# Altium schematic sheet Sheet1.SchDoc
size A2; DrawnBy: Баринов; Razrabotal: {Разработал}; Utverdil: {Утвердил}; Oboznachenie: {Обозначение}; PageSetup: Record=PageOptions|CenterHorizontal=True|CenterVertical=True|PrintScale=1.05|XCorrection=0.00|YCorrection=0.00|PrintKind=2|BorderSize=5000000|LeftOffset=0|BottomOffset=0|Orientation=2|PaperLength=1000|PaperWidth=1000|Scale=100|PaperSource=15|PrintQuality=-3|MediaType=1|DitherType=10|PrintScaleMode=1|PaperKind=ANSI D|PaperIndex=122
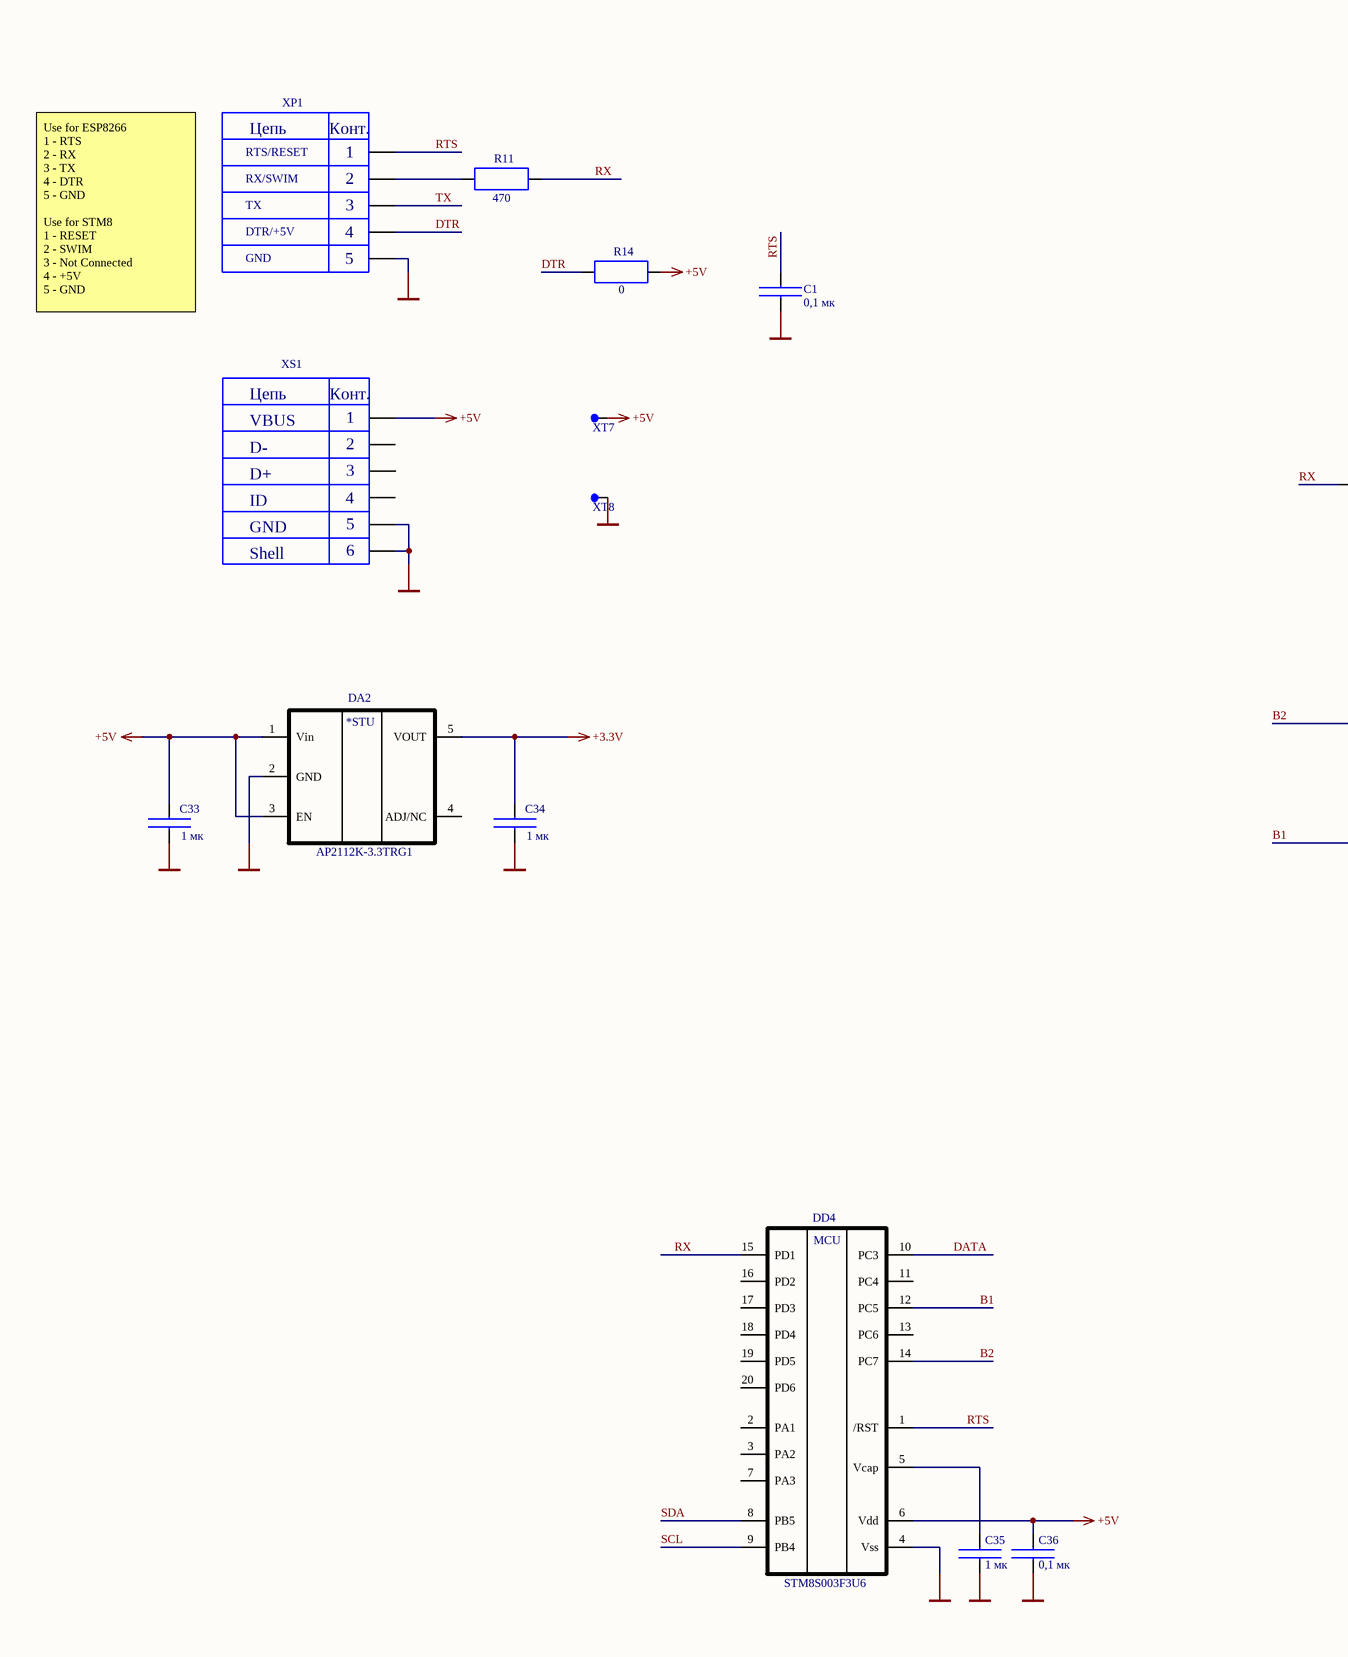
[diagram p0: Sheet1.SchDoc, left]
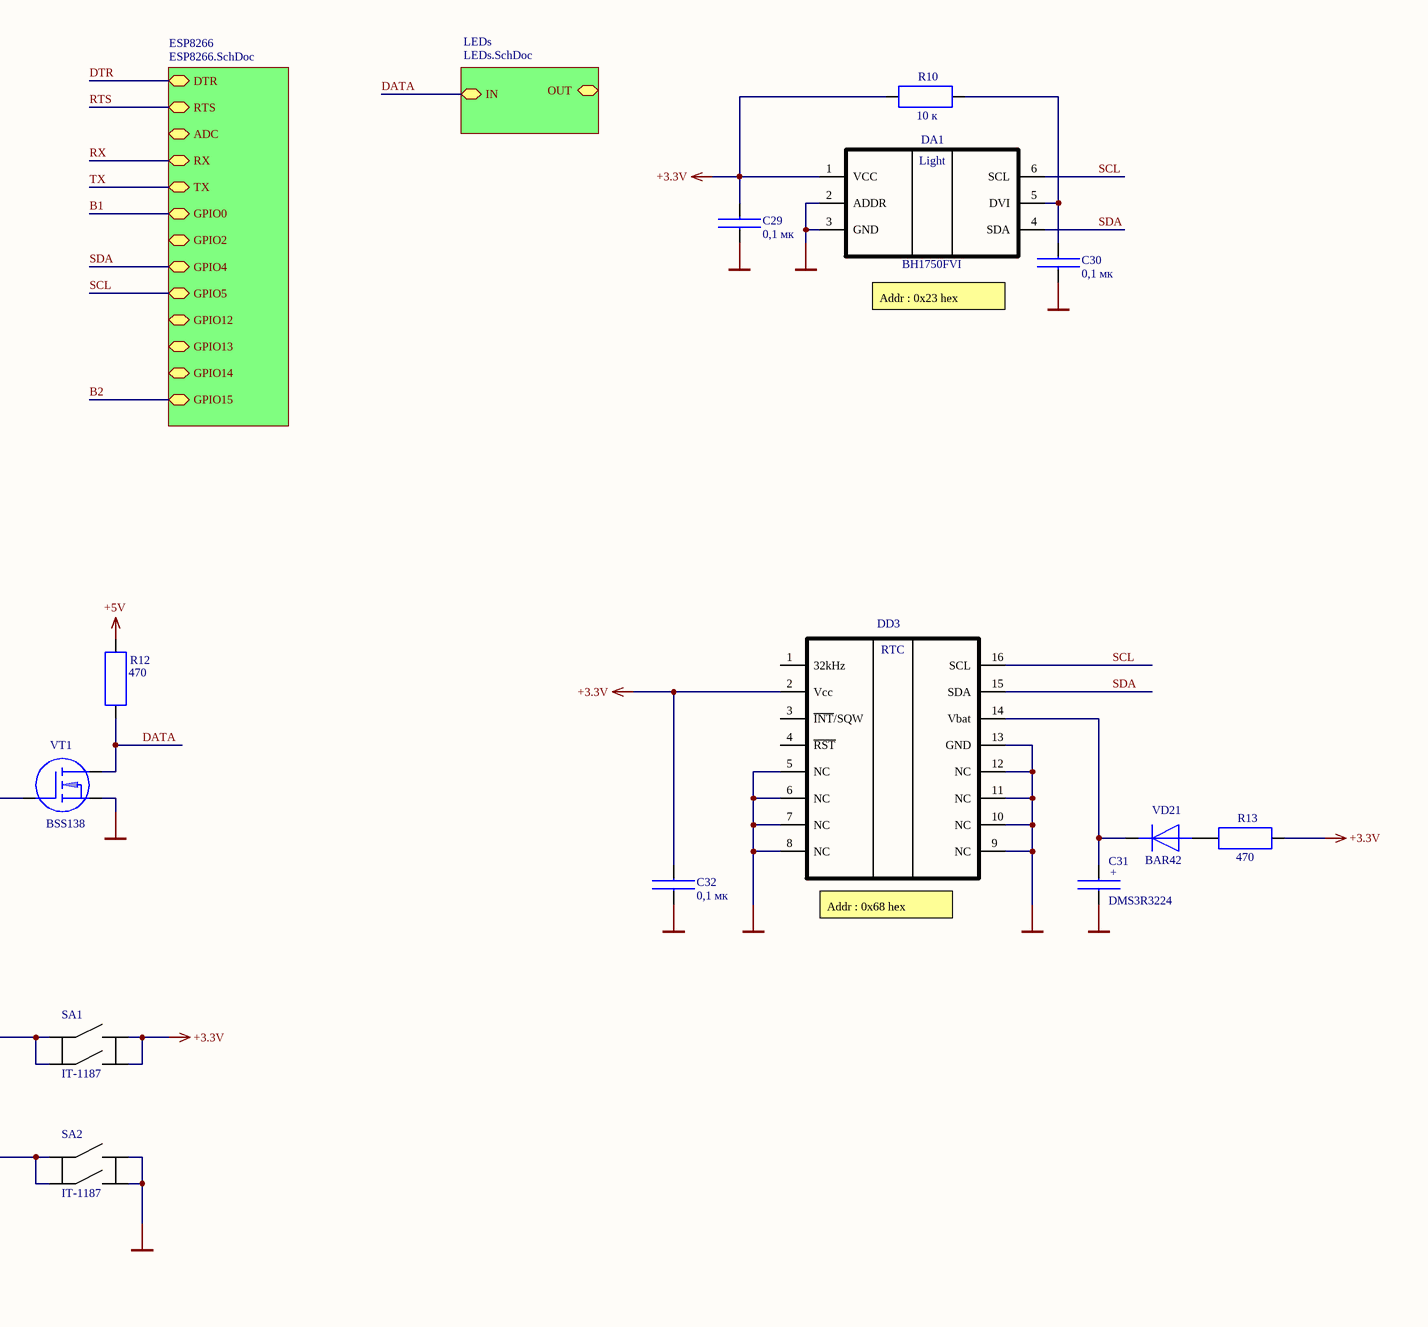
[diagram p1: Sheet1.SchDoc, right]

## Parts
C1  0,1 мк  [CC1608(0603)x09]
C29  0,1 мк  [CC1608(0603)x09]
C30  0,1 мк  [CC1608(0603)x09]
C31  DMS3R3224  [DMS3R3224]
C32  0,1 мк  [CC1608(0603)x09]
C33  1 мк  [CC1608(0603)x09]
C34  1 мк  [CC1608(0603)x09]
C35  1 мк  [CC1608(0603)x09]
C36  0,1 мк  [CC1608(0603)x09]
DA1  BH1750FVI  [WSOF6I]
DA2  AP2112K-3.3TRG1  [SOT23-5]
DD3  DS3231  [SOIC127P1030X250-16N]  (value not drawn)
DD4  STM8S003F3U6  [QFN50P300X300X55_HS-21N]
R10  10 к  [RC1608(0603)x06]
R11  470  [RC1608(0603)x06]
R12  470  [RC1608(0603)x06]
R13  470  [RC1608(0603)x06]
R14  0  [RC1608(0603)x06]
SA1  IT-1187  [IT-1187]
SA2  IT-1187  [IT-1187]
VD21  BAR42  [SOT-23]
VT1  BSS138  [SOT-23]
XP1  header5p_2.54  [header5p_2.54_no3d_noSilk]  (value not drawn)
XS1  USB/Mc-1J  [USB/Mc-1J]  (value not drawn)
XT7  XT3  [XT3]  (value not drawn)
XT8  XT3  [XT3]  (value not drawn)

## Sub-sheets
ESP8266 = ESP8266.SchDoc: DTR, RTS, ADC, RX, TX, GPIO0, GPIO2, GPIO4, GPIO5, GPIO12, GPIO13, GPIO14, GPIO15
LEDs = LEDs.SchDoc: IN, OUT

## Nets
+3.3V: C29.1 C32.1 C34.1 DA1.1(VCC) DA2.5(VOUT) DD3.2(Vcc) R10.2 R13.1 SA1.3 SA1.4
+5V: C33.1 C36.1 DA2.1(Vin) DA2.3(EN) DD4.6(Vdd) R12.2 R14.1 XS1.1 XT7.1
GND: C1.2 C29.2 C30.2 C31.- C32.2 C33.2 C34.2 C35.2 C36.2 DA1.2(ADDR) DA1.3(GND) DA2.2(GND) DD3.5(NC) DD3.6(NC) DD3.7(NC) DD3.8(NC) DD3.9(NC) DD3.10(NC) DD3.11(NC) DD3.12(NC) DD3.13(GND) DD4.4(Vss) SA2.3 SA2.4 VT1.2(S) XP1.5 XS1.5 XS1.SH(Shell) XT8.1
B1: DD4.12(PC5) SA2.1 SA2.2 ; sheet ESP8266/GPIO0
B2: DD4.14(PC7) SA1.1 SA1.2 ; sheet ESP8266/GPIO15
DATA: DD4.10(PC3) R12.1 VT1.3(D) ; sheet LEDs/IN
DTR: R14.2 XP1.4 ; sheet ESP8266/DTR
RTS: C1.1 DD4.1(/RST) XP1.1 ; sheet ESP8266/RTS
RX: DD4.15(PD1) R11.1 VT1.1(G) ; sheet ESP8266/RX
SCL: DA1.6(SCL) DD3.16(SCL) DD4.9(PB4) ; sheet ESP8266/GPIO5
SDA: DA1.4(SDA) DD3.15(SDA) DD4.8(PB5) ; sheet ESP8266/GPIO4
TX: XP1.3 ; sheet ESP8266/TX
NetC30_1: C30.1 DA1.5(DVI) R10.1
NetC31_+: C31.+ DD3.14(Vbat) VD21.3
NetC35_1: C35.1 DD4.5(Vcap)
NetR11_2: R11.2 XP1.2
NetR13_2: R13.2 VD21.1

Not connected (* = marked no-connect by the designer): DA2 4(ADJ/NC); DD3 1(32kHz) 3(~{INT}/SQW) 4(~{RST}); DD4 2(PA1) 3(PA2) 7(PA3) 11(PC4) 13(PC6) 16(PD2) 17(PD3) 18(PD4) 19(PD5) 20(PD6); XS1 2 3 4

## Notes on the sheet
- Addr : 0x23 hex
- RTS/RESET
- RX/SWIM
- TX
- DTR/+5V
- GND
- Use for ESP8266
  1 - RTS
  2 - RX
  3 - TX
  4 - DTR
  5 - GND
  Use for STM8
  1 - RESET
  2 - SWIM
  3 - Not Connected
  4 - +5V
  5 - GND
- (near DD3) Addr : 0x68 hex
- Title
- Size:
- Date:
- File:
- A2
- Number:
- Time:
- Revision:
- Sheet
- of
- (in symbol AP2112K-3.3TRG1) *STU
- (in symbol BH1750FVI) Light
- (in symbol DS3231) RTC
- (in symbol header5p_2.54) Цепь; Конт.
- (in symbol STM8S003F3U6) MCU
- (in symbol USB/Mc-1J) Цепь; Конт.; VBUS; D-; D+; ID; GND; 6

## Library data of the parts
C1 C29 C30 C32-C36 = CC0603 X7R uF0.22 V25/16: Ceramic Chip-capacitor 0603; Name: Конденсатор 0603-0.22 мкФ X7R 25/16V; Voltage: 25 / 16; Vendor1: AVX Corporation; Vendor2: KEMET Electronics Corporation, USA; Vendor2Name: C0603C224K3RAC (25V), C0603C224K4RAC (16V); Ta: -55+125; Vendor3: Murata Manufacturing Co., Ltd, Japan; Vendor3Name: GRM188R71E224K (25V), GRM188R71C224K (16V); Vendor4: Panasonic (Matsushita Electric Co.), Japan; Vendor4Name: ECJ1VB1C224K (16V); Vendor5: Samsung, Korea; Vendor5Name: CL10B224KO8NNNC (16V); Vendor6: Taiyo Yuden Co., Ltd., Japan; Vendor6Name: EMK107BJ224KA-T (16V); Vendor7: TDK Corp., Japan; Vendor7Name: C1608X7R1E224K (25V); Vendor8: Vishay Intertechnology, Inc., USA; Vendor8Name: VJ0603Y224KXJCW1BC (16V); Vendor9: Yageo Corp., Taiwan; Vendor9Name: CC0603KRX7R7BN224 / 2238 786 15654 (16V); Type: Capacitor; Vendor1Name: N/A
R10-R14 = 1% R0603-K15.0: Chip Resistor 0603; Name: Резистор 0603-15.0 кОм±1%; Vendor1: Bourns, Inc., USA; Vendor1Name: CR0603-FX-(RCode4dig)E(LF); Vendor2: KOA Speer Electronics, Inc., USA; Vendor2Name: RK73H1JT(L)TD(RCode4dig)F; Vendor3: NIC Components Corp., USA; Vendor3Name: NRC06F(RCode4dig)TRF; Ta: -55+125; Vendor4: Panasonic (Matsushita Electric Corporation), Japan; Vendor4Name: ERJ3EKF(RCode4dig)V; PowerRating: 0.1W; Vendor5: Rohm Co., Ltd., Japan; Vendor5Name: MCR03EZPFX(RCode4dig); Vendor6: Samsung, Korea; Vendor6Name: RC1608F(RCode4dig)CS; Vendor7: SEI Stackpole Electronics, Inc., USA; Vendor7Name: RMC1/16(RValue)1%R; Vendor8: Vishay Intertechnology, Inc., USA; Vendor8Name: CRCW0603(RCode1RKM)FKEA; Vendor9: Yageo Corporation, Taiwan; Vendor9Name: RC0603FR-07(RCode1RKM)L; Type: Resistor
SA1 SA2 = IT-1187: SMD Switch
XS1 = USB/Mc-1J: Connector SMD USB Micro